# Altium schematic sheet BQ51003YFPT_WirelessCharger_2.5W.SchDoc
size A4; Organization: Arribada Initiative; Address1: https://github.com/arribada; Address2: contact@arribada.org; Address3: arribada.org; Address4: UK - Portsmouth; DocumentNumber: 4; SheetNumber: 4; SheetTotal: 13
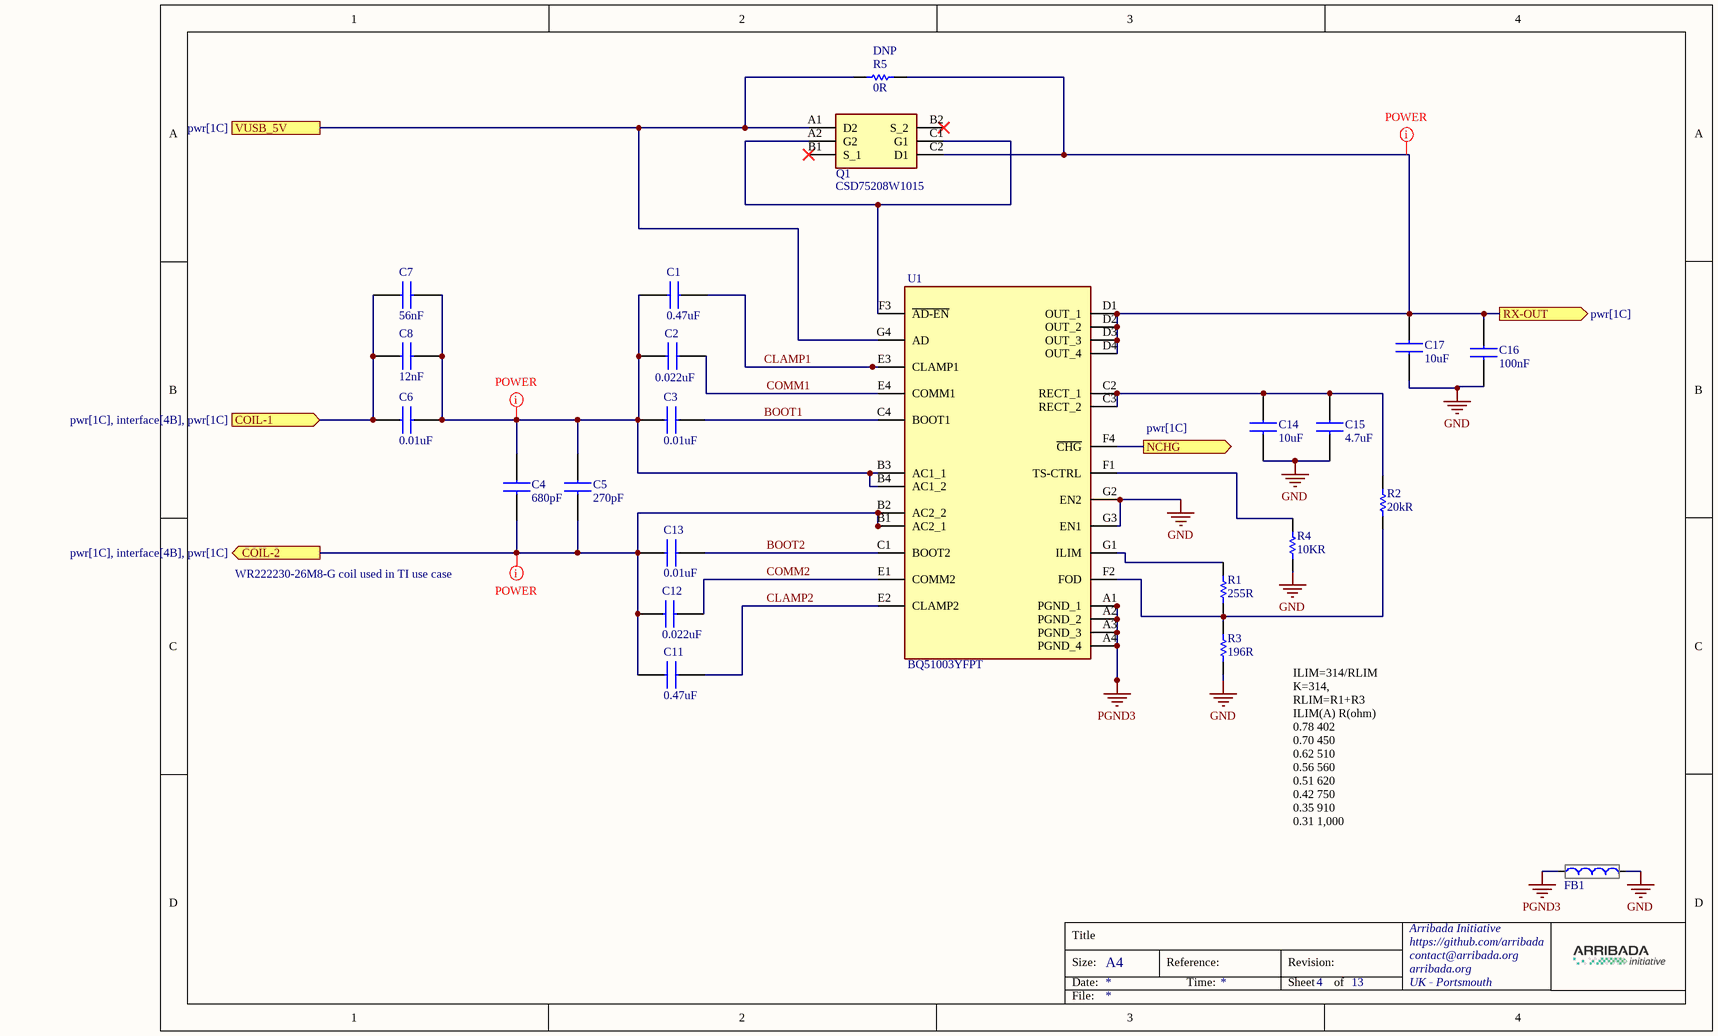
[diagram p0: BQ51003YFPT_WirelessCharger_2.5W.SchDoc]

## Parts
C1  value 0.47uF  [GRM18x]  (hidden comment: GRM188R71E474KA12D)
C2  value 0.022uF  [GRM15x]  (hidden comment: GRM155R71E223KA61D)
C3  value 0.01uF  [CAPC1005X70N]  (hidden comment: GRM155R71E103KA01D)
C4  value 680pF  [CAPC1005X70N]  (hidden comment: GRM155R71H681KA01D)
C5  value 270pF  [CAPC1005X70N]  (hidden comment: GRM155R71H271KA01J)
C6  value 0.01uF  [CAPC1608X90N]  (hidden comment: GRM188R71H103KA01D)
C7  value 56nF  [CAPC1608X90N]  (hidden comment: GCJ188R71H563KA12J)
C8  value 12nF  [CAPC1608X90N]  (hidden comment: C0603C123K5RACTU)
C11  value 0.47uF  [GRM18x]  (hidden comment: GRM188R71E474KA12D)
C12  value 0.022uF  [GRM15x]  (hidden comment: GRM155R71E223KA61D)
C13  value 0.01uF  [CAPC1005X70N]  (hidden comment: GRM155R71E103KA01D)
C14  Parameter 1: 10uF  [CAPC1709X100N]  (hidden comment: EMK107BBJ106MA-T)
C15  value 4.7uF  [CAPC1608X90N]  (hidden comment: GRM188R61C475KE11J)
C16  value 100nF  [0402]  (hidden comment: GRM155R71C104KA88D)
C17  Parameter 1: 10uF  [CAPC1709X100N]  (hidden comment: EMK107BBJ106MA-T)
FB1  BLM18AG102SN1D  [BLM18SP221SN1B]  (value not drawn)
Q1  CSD75208W1015  [BGA6C50P2X3_95X145X62]
R1  value 255R  [RESC0603X28N]  (hidden comment: ERJ-1GNF2550C)
R2  value 20kR  [RESC0603X28N]  (hidden comment: CRCW020120K0FKED)
R3  value 196R  [RESC0603X28N]  (hidden comment: CRCW0201196RFKED)
R4  value 10KR  [RESC0603X26N]  (hidden comment: RC0201FR-7D10KL)
R5  DNP  value 0R  [RESC1005X40N]
U1  BQ51003YFPT  [BGA28C40P4X7_188X301X50]

## Ports
COIL-1 (in, see pwr[1C], interface[4B], pwr[1C]), COIL-2 (out, see pwr[1C], interface[4B], pwr[1C]), NCHG (out, see pwr[1C]), RX-OUT (out, see pwr[1C]), VUSB_5V (see pwr[1C])

## Nets
GND: C14.2 C15.2 C16.2 C17.2 FB1.2 R3.2 R4.2 U1.G2(EN2) U1.G3(EN1)
PGND3: FB1.1 U1.A1(PGND_1) U1.A2(PGND_2) U1.A3(PGND_3) U1.A4(PGND_4)
BOOT1: C3.2 U1.C4(BOOT1)
BOOT2: C13.2 U1.C1(BOOT2)
CLAMP1: C1.2 U1.E3(CLAMP1)
CLAMP2: C11.2 U1.E2(CLAMP2)
COIL-1: C6.1 C7.1 C8.1 ; port COIL-1
COIL-2: C4.1 C5.1 C11.1 C12.1 C13.1 U1.B1(AC2_1) U1.B2(AC2_2) ; port COIL-2
COMM1: C2.2 U1.E4(COMM1)
COMM2: C12.2 U1.E1(COMM2)
NCHG: U1.F4(~{CHG}) ; port NCHG
RX-OUT: C16.1 C17.1 Q1.C2(D1) R5.2 U1.D1(OUT_1) U1.D2(OUT_2) U1.D3(OUT_3) U1.D4(OUT_4) ; port RX-OUT
VUSB_5V: Q1.A1(D2) R5.1 U1.G4(AD) ; port VUSB_5V
NetC1_1: C1.1 C2.1 C3.1 C4.2 C5.2 C6.2 C7.2 C8.2 U1.B3(AC1_1) U1.B4(AC1_2)
NetC14_1: C14.1 C15.1 R2.1 U1.C2(RECT_1) U1.C3(RECT_2)
NetQ1_A2: Q1.A2(G2) Q1.C1(G1) U1.F3(~{AD-EN})
NetR1_1: R1.1 R2.2 R3.1 U1.F2(FOD)
NetR1_2: R1.2 U1.G1(ILIM)
NetR4_1: R4.1 U1.F1(TS-CTRL)

Not connected (* = marked no-connect by the designer): Q1 B1(S_1)* B2(S_2)*

## Layout directives
net class POWER; rule Width Constraint [Pref Width = 0.5mm    Min Width = 0.4mm    Max Width = 1mm]: COIL-2, NetC1_1, RX-OUT

## Notes on the sheet
- WR222230-26M8-G coil used in TI use case
- ILIM=314/RLIM
  K=314,
  RLIM=R1+R3
  ILIM(A) R(ohm)
  0.78 402
  0.70 450
  0.62 510
  0.56 560
  0.51 620
  0.42 750
  0.35 910
  0.31 1,000
- Title
- Size:
- Date:
- A4
- Reference:
- Time:
- Revision:
- Sheet
- of
- File:

## Library data of the parts
C1 C11 = GRM188R71E474KA12D: Multilayer Ceramic Capacitors MLCC - SMD/SMT 0.47 uF 25 VDC 10% 0603 X7R; Manufacturer_Name: Murata Electronics; Datasheet Link: https://search.murata.co.jp/Ceramy/image/img/A01X/G101/ENG/GRM188R71E474KA12-01A.pdf; Height: 0.9mm; Manufacturer_Part_Number: GRM188R71E474KA12D; Mouser Part Number: 81-GRM188R71E474KA12; Mouser Price/Stock: https://www.mouser.co.uk/ProductDetail/Murata-Electronics/GRM188R71E474KA12D?qs=5VWgUag8BO05DbKPNL84bA%3D%3D; Arrow Part Number: GRM188R71E474KA12D; Arrow Price/Stock: https://www.arrow.com/en/products/grm188r71e474ka12d/murata-manufacturing?region=nac
C2 C12 = GRM155R71E223KA61D: Multilayer Ceramic Capacitors MLCC - SMD/SMT 0.022 uF 25 VDC 10% 0402 X7R; Manufacturer_Name: Murata Electronics; Datasheet Link: https://search.murata.co.jp/Ceramy/image/img/A01X/G101/ENG/GRM155R71E223KA61-01A.pdf; Height: 0.33mm; Manufacturer_Part_Number: GRM155R71E223KA61D; Mouser Part Number: 81-GRM155R71E223KA6D; Mouser Price/Stock: https://www.mouser.co.uk/ProductDetail/Murata-Electronics/GRM155R71E223KA61D?qs=9U7yHM2lsjSSaDbUOqtIbw%3D%3D; Arrow Part Number: GRM155R71E223KA61D; Arrow Price/Stock: https://www.arrow.com/en/products/grm155r71e223ka61d/murata-manufacturing?region=nac
C3 C13 = GRM155R71E103KA01D: Multilayer Ceramic Capacitors MLCC - SMD/SMT 0.01 uF 25 VDC 10% 0402 X7R; Manufacturer_Name: Murata Electronics; Datasheet Link: https://search.murata.co.jp/Ceramy/image/img/A01X/G101/ENG/GRM155R71E103KA01-01A.pdf; Height: 0.7mm; Manufacturer_Part_Number: GRM155R71E103KA01D; Mouser Part Number: 81-GRM36X103K25; Mouser Price/Stock: https://www.mouser.co.uk/ProductDetail/Murata-Electronics/GRM155R71E103KA01D?qs=tOieHv2smhmMGFtkNVb1ug%3D%3D; Arrow Part Number: GRM155R71E103KA01D; Arrow Price/Stock: https://www.arrow.com/en/products/grm155r71e103ka01d/murata-manufacturing?utm_currency=USD&region=nac
C4 = GRM155R71H681KA01D: Multilayer Ceramic Capacitors MLCC - SMD/SMT 680 pF 50 VDC 10% 0402 X7R; Manufacturer_Name: Murata Electronics; Datasheet Link: https://search.murata.co.jp/Ceramy/image/img/A01X/G101/ENG/GRM155R71H681KA01-01A.pdf; Height: 0.7mm; Manufacturer_Part_Number: GRM155R71H681KA01D; Mouser Part Number: 81-GRM15R71H681KA01D; Mouser Price/Stock: https://www.mouser.com/Search/Refine.aspx?Keyword=81-GRM15R71H681KA01D; Arrow Part Number: GRM155R71H681KA01D; Arrow Price/Stock: https://www.arrow.com/en/products/grm155r71h681ka01d/murata-manufacturing
C5 = GRM155R71H271KA01J: Multilayer Ceramic Capacitors MLCC - SMD/SMT 270 pF 50 VDC 10% 0402 X7R; Manufacturer_Name: Murata Electronics; Datasheet Link: https://search.murata.co.jp/Ceramy/image/img/A01X/G101/ENG/GRM155R71H271KA01-01A.pdf; Height: 0.7mm; Manufacturer_Part_Number: GRM155R71H271KA01J; Mouser Part Number: 81-GRM155R71H271KA1J; Mouser Price/Stock: https://www.mouser.co.uk/ProductDetail/Murata-Electronics/GRM155R71H271KA01J?qs=tpjTAP4gRjgpE42GcIn2vg%3D%3D
C6 = GRM188R71H103KA01D: Multilayer Ceramic Capacitors MLCC - SMD/SMT .01UF 50V 10% 0603; Manufacturer_Name: Murata Electronics; Datasheet Link: https://search.murata.co.jp/Ceramy/image/img/A01X/G101/ENG/GRM188R71H103KA01-01.pdf; Height: 0.9mm; Manufacturer_Part_Number: GRM188R71H103KA01D; Mouser Part Number: 81-GRM39X103K50D; Mouser Price/Stock: https://www.mouser.co.uk/ProductDetail/Murata-Electronics/GRM188R71H103KA01D?qs=WWniysbtxULrL2ljbViAbw%3D%3D; Arrow Part Number: GRM188R71H103KA01D; Arrow Price/Stock: https://www.arrow.com/en/products/grm188r71h103ka01d/murata-manufacturing?region=europe
C7 = GCJ188R71H563KA12J: Multilayer Ceramic Capacitors MLCC - SMD/SMT 0.056 uF 50 VDC 10% 0603 X7R AEC-Q200; Manufacturer_Name: Murata Electronics; Datasheet Link: https://search.murata.co.jp/Ceramy/image/img/A01X/G101/ENG/GCJ188R71H563KA12-02B.pdf; Height: 0.9mm; Manufacturer_Part_Number: GCJ188R71H563KA12J
C8 = C0603C123K5RACTU: Multilayer Ceramic Capacitors MLCC - SMD/SMT 50V 0.012uF X7R 0603 10%; Manufacturer: KEMET; Material: 4241ConductorMaterial; Dissipation Factor: 2.5%; Temperature Coefficient: 30ppm/°C; Supplier: Mouser; Supplier Part Number: 80-C0603C123K5R; Manufacturer Part Number: C0603C123K5RACTU; RoHS: Yes; Category: Ceramic Capacitors; Stock: 158221; Pricing: 1=0,1, 10=0,043, 50=0,043, 100=0,022, 1000=0,017, 10000=0,009 (USD); Mounting Technology: Surface Mount,PCB; Case/Package: 0603; Pins: 2; Dielectric Material: Ceramic; Case Code (Metric): 1608; Case Code (Imperial): 0603; Min Operating Temperature: -55°C; Max Operating Temperature: 125°C; Voltage Rating: 50V; Tolerance: 10%; Voltage Rating (DC): 50V; Series: C; Package Quantity: 1; Packaging: Tape and Reel; Dielectric: X7R; Termination: SMD/SMT; Voltage: 50V; Construction: Flat; Length: 1.6mm; Width: 0.031inch; Height: 0.8mm; Thickness: 0.034inch; Lead Pitch: 0.7mm; Depth: 0.8mm; Radiation Hardening: No; RoHS Compliant: Yes; Reach SVHC Compliant: No; ComponentLink1URL: https://datasheet.ciiva.com/7823/1633156-7823622.pdf?src-supplier=Element14; ComponentLink1Description: https://datasheet.ciiva.com/7823/1633156-7823622.pdf?src-supplier=Element14; ComponentLink2URL: https://datasheet.ciiva.com/22693/1851736-22693981.pdf?src-supplier=Element14; ComponentLink2Description: https://datasheet.ciiva.com/22693/1851736-22693981.pdf?src-supplier=Element14; ComponentLink3URL: https://datasheet.ciiva.com/18192/getdatasheetpartid-321522-18192780.pdf?src-supplier=Verical; ComponentLink3Description: https://datasheet.ciiva.com/18192/getdatasheetpartid-321522-18192780.pdf?src-supplier=Verical
C14 C17 = EMK107BBJ106MA-T: Multilayer Ceramic Capacitors MLCC - SMD/SMT 963-MSASE168BB5106MT RPLCMT PN 16V 10uF X5R 0603 20%; Manufacturer_Name: TAIYO YUDEN; Datasheet Link: https://ds.yuden.co.jp/TYCOMPAS/or/specSheet?pn=MSASE168BB5106MTNA01; Height: 1mm; Manufacturer_Part_Number: EMK107BBJ106MA-T; Mouser Part Number: 963-EMK107BBJ106MA-T; Mouser Price/Stock: https://www.mouser.co.uk/ProductDetail/Taiyo-Yuden/EMK107BBJ106MA-T?qs=%252BAZVS4b%2FkgLbAKVTp0R69Q%3D%3D
C15 = GRM188R61C475KE11J: Multilayer Ceramic Capacitors MLCC - SMD/SMT 4.7 uF 16 VDC 10% 0603 X5R; Manufacturer_Name: Murata Electronics; Datasheet Link: https://search.murata.co.jp/Ceramy/image/img/A01X/G101/ENG/GRM188R61C475KE11-01A.pdf; Height: 0.9mm; Manufacturer_Part_Number: GRM188R61C475KE11J; Mouser Part Number: 81-GRM188R61C475KE1J; Mouser Price/Stock: https://www.mouser.co.uk/ProductDetail/Murata-Electronics/GRM188R61C475KE11J?qs=hNud%2FORuBR3XOr3EtjXAYA%3D%3D; Arrow Part Number: GRM188R61C475KE11J; Arrow Price/Stock: null?region=nac
C16 = GRM155R71C104KA88D: Multilayer Ceramic Capacitors MLCC - SMD/SMT 0.1 uF 16 VDC 10% 0402 X7R; Manufacturer_Part_Number: CC0402KRX7R7BB104; Manufacturer: YAGEO; Manufacturer 1: Murata; Description 1: 0402 0.1 uF 16V ±10 % Tolerance X7R SMT Multilayer Ceramic Capacitor; Voltage Rating: 16V; Package: C0402; Supplier 1: Mouser; Supplier Part Number 1: 81-GRM155R71C104KA88; Manufacturer Part Number 1: GRM155R71C104KA88D; RoHS 1: Yes; Category 1: Ceramic Capacitors; Stock 1: 7816691; Pricing 1: 1=0,1, 10=0,017, 50=0,017, 100=0,01, 1000=0,008, 10000=0,005 (USD); Mount: Surface Mount; Case/Package: 0402; Number of Pins: 2; Case Code (Metric): 1005; Case Code (Imperial): 0402; Material: Ceramic; Dielectric Material: Ceramic; Min Operating Temperature: -55°C; Max Operating Temperature: 125°C; Capacitance: 100nF; Tolerance: 10%; Packaging: Tape and Reel; Voltage Rating (DC): 16V; Package Quantity: 1; Dielectric: X7R; Termination: SMD/SMT; Voltage: 16V; Series: GRM; Length: 1mm; Width: 0.02inch; Height: 0.5mm; Thickness: 0.022inch; Depth: 0.5mm; Radiation Hardening: No; Lead Free: Lead Free; RoHS Compliant: Yes; Reach SVHC Compliant: Unknown; ComponentLink1URL: https://datasheet.ciiva.com/129/grm155r71c104ka88-01-129739.pdf?src-supplier=Digi-Key; ComponentLink1Description: https://datasheet.ciiva.com/129/grm155r71c104ka88-01-129739.pdf?src-supplier=Digi-Key; ComponentLink2URL: https://datasheet.ciiva.com/129/grm155r71c104ka88-01-129740.pdf?src-supplier=Digi-Key; ComponentLink2Description: https://datasheet.ciiva.com/129/grm155r71c104ka88-01-129740.pdf?src-supplier=Digi-Key; ComponentLink3URL: https://datasheet.ciiva.com/29199/454098-da-01-en-vs-kondensator-0402-29199799.pdf?src-supplier=Conrad; ComponentLink3Description: https://datasheet.ciiva.com/29199/454098-da-01-en-vs-kondensator-0402-29199799.pdf?src-supplier=Conrad; ComponentLink4URL: https://datasheet.ciiva.com/7937/4360-7937615.pdf?src-supplier=Element14; ComponentLink4Description: https://datasheet.ciiva.com/7937/4360-7937615.pdf?src-supplier=Element14; ComponentLink5URL: https://datasheet.ciiva.com/14116/grmseries-highdielectrictype-eng-14116878.pdf?src-supplier=Distrelec; ComponentLink5Description: https://datasheet.ciiva.com/14116/grmseries-highdielectrictype-eng-14116878.pdf?src-supplier=Distrelec; ComponentLink6URL: https://datasheet.ciiva.com/14103/grmseries-highdielectrictype-eng-14103750.pdf?src-supplier=Distrelec; ComponentLink6Description: https://datasheet.ciiva.com/14103/grmseries-highdielectrictype-eng-14103750.pdf?src-supplier=Distrelec; ComponentLink7URL: https://datasheet.ciiva.com/28534/4360-28534127.pdf?src-supplier=Element14; ComponentLink7Description: https://datasheet.ciiva.com/28534/4360-28534127.pdf?src-supplier=Element14; ComponentLink8URL: https://datasheet.ciiva.com/28534/4360-28534133.pdf?src-supplier=Element14; ComponentLink8Description: https://datasheet.ciiva.com/28534/4360-28534133.pdf?src-supplier=Element14
FB1 = BLM18AG102SN1D: Ferrite Bead - 1000 OHM 25%; Manufacturer_Name: Murata Electronics; Datasheet Link: http://www.murata.com/~/media/webrenewal/support/library/catalog/products/emc/emifil/c31e.ashx?la=en-gb; Height: 0.95mm; Manufacturer_Part_Number: BLM18AG102SN1D; Mouser Part Number: 81-BLM11A102S; Mouser Price/Stock: https://www.mouser.co.uk/ProductDetail/Murata-Electronics/BLM18AG102SN1D?qs=b2kFoOhrN4V4XjRBmusv4w%3D%3D; Arrow Part Number: BLM18AG102SN1D; Arrow Price/Stock: https://www.arrow.com/en/products/blm18ag102sn1d/murata-manufacturing?utm_currency=USD&region=nac
Q1 = CSD75208W1015: MOSFETs 20V P-channel NexFET Pwr MOSFET A 595-CSD75208W1015T; Manufacturer_Name: Texas Instruments; Datasheet Link: http://www.ti.com/lit/ds/symlink/csd75208w1015.pdf; Height: 0.625mm; Manufacturer_Part_Number: CSD75208W1015; Mouser Part Number: 595-CSD75208W1015; Mouser Price/Stock: https://www.mouser.co.uk/ProductDetail/Texas-Instruments/CSD75208W1015?qs=m%2F7bTylgptfyaJivndQoYw%3D%3D; Arrow Part Number: CSD75208W1015; Arrow Price/Stock: https://www.arrow.com/en/products/csd75208w1015/texas-instruments?region=nac
R1 = ERJ-1GNF2550C: Thick Film Resistors - SMD 0201 255ohm 1% HalogenFree AEC-Q200; Manufacturer_Name: Panasonic; Datasheet Link: https://industrial.panasonic.com/cdbs/www-data/pdf/RDA0000/AOA0000C301.pdf; Height: 0.26mm; Manufacturer_Part_Number: ERJ-1GNF2550C
R2 = CRCW020120K0FKED: Res Thick Film 0201 453 Ohm 1% 1/20W ±100ppm/°C Molded SMD SMD Paper T/R; Manufacturer_Name: Vishay; Manufacturer: Vishay Dale; Manufacturer Part Number: CRCW0201453RFKED; Power Rating: 50mW; Voltage Rating: 30V; Datasheet Link: http://www.vishay.com/docs/20035/dcrcwe3.pdf; Height: 0.28mm; Manufacturer_Part_Number: CRCW020120K0FKED; Mouser Part Number: 71-CRCW020120K0FKED; Mouser Price/Stock: https://www.mouser.co.uk/ProductDetail/Vishay-Dale/CRCW020120K0FKED?qs=1%252BOKmYoxJmkUY7PW7c9G2g%3D%3D; Arrow Part Number: CRCW020120K0FKED; Arrow Price/Stock: https://www.arrow.com/en/products/crcw020120k0fked/vishay; Supplier: Mouser; Supplier Part Number: 71-CRCW0201453RFKED; RoHS: Yes; Category: Chip SMD Resistors; Stock: 8250; Pricing: 1=0,21, 10=0,091, 50=0,091, 100=0,063, 1000=0,043, 10000=0,029 (USD); Case/Package: 0201; Weight: 6E-06oz; Case Code (Imperial): 0201; Case Code (Metric): 0603; Contact Plating: Tin; Min Operating Temperature: -55°C; Max Operating Temperature: 155°C; Packaging: Tape and Reel; Tolerance: 1%; Package Quantity: 10000; Termination: SMD/SMT; Number of Terminations: 2; Max Power Dissipation: 50mW; Temperature Coefficient: 100ppm/°C; Voltage Rating (DC): 30V; Series: CRCW; Length: 0.024inch; Width: 0.3mm; Radiation Hardening: No; Lead Free: Lead Free; RoHS Compliant: Yes; ComponentLink1URL: https://datasheet.ciiva.com/8935/crcw0201e3-8935846.pdf?src-supplier=Avnet; ComponentLink1Description: https://datasheet.ciiva.com/8935/crcw0201e3-8935846.pdf?src-supplier=Avnet; ComponentLink2URL: https://datasheet.ciiva.com/2580/crcw0201e3-2580478.pdf?src-supplier=Digikey; ComponentLink2Description: https://datasheet.ciiva.com/2580/crcw0201e3-2580478.pdf?src-supplier=Digikey
R3 = CRCW0201196RFKED: Thick Film Resistors - SMD 1/20watt 196ohms 1% 100ppm
R4 = RC0201FR-7D10KL: Thick Film Resistors - SMD 10 kOhms 50 mW 0201 1%; Manufacturer_Name: KEMET; Datasheet Link: http://www.yageo.com/documents/recent/PYu-RC0201_51_RoHS_L_8.pdf; Height: 0.26mm; Manufacturer_Part_Number: RC0201FR-7D10KL; Mouser Part Number: 603-RC0201FR-7D10KL; Mouser Price/Stock: https://www.mouser.co.uk/ProductDetail/YAGEO/RC0201FR-7D10KL?qs=F5EMLAvA7ICAEt2%2Fo%2FBSlA%3D%3D
R5 = CRCW04020000Z0EEHP: Thick Film Resistors - SMD CRCW 402 jumper; Manufacturer_Name: Vishay; Datasheet Link: http://www.vishay.com/docs/20035/dcrcwe3.pdf; Height: 0.4mm; Manufacturer_Part_Number: CRCW04020000Z0EEHP; Mouser Part Number: 71-CRCW04020000Z0EEH; Mouser Price/Stock: https://www.mouser.co.uk/ProductDetail/Vishay-Dale/CRCW04020000Z0EEHP?qs=Imq1NPwxi74NTc567q7flQ%3D%3D; Arrow Part Number: CRCW04020000Z0EEHP; Arrow Price/Stock: https://www.arrow.com/en/products/crcw04020000z0eehp/vishay?utm_currency=USD&region=nac
U1 = BQ51003YFPT: Wireless Charging ICs Wireless Pwr Receivr A 595-BQ51003YFPR; Manufacturer_Name: Texas Instruments; Datasheet Link: http://www.ti.com/lit/gpn/BQ51003; Height: 0.5mm; Manufacturer_Part_Number: BQ51003YFPT; Mouser Part Number: 595-BQ51003YFPT; Mouser Price/Stock: https://www.mouser.co.uk/ProductDetail/Texas-Instruments/BQ51003YFPT?qs=QCUnHQQYO1rX6GZ4rUhwCg%3D%3D; Arrow Part Number: BQ51003YFPT; Arrow Price/Stock: https://www.arrow.com/en/products/bq51003yfpt/texas-instruments?region=nac